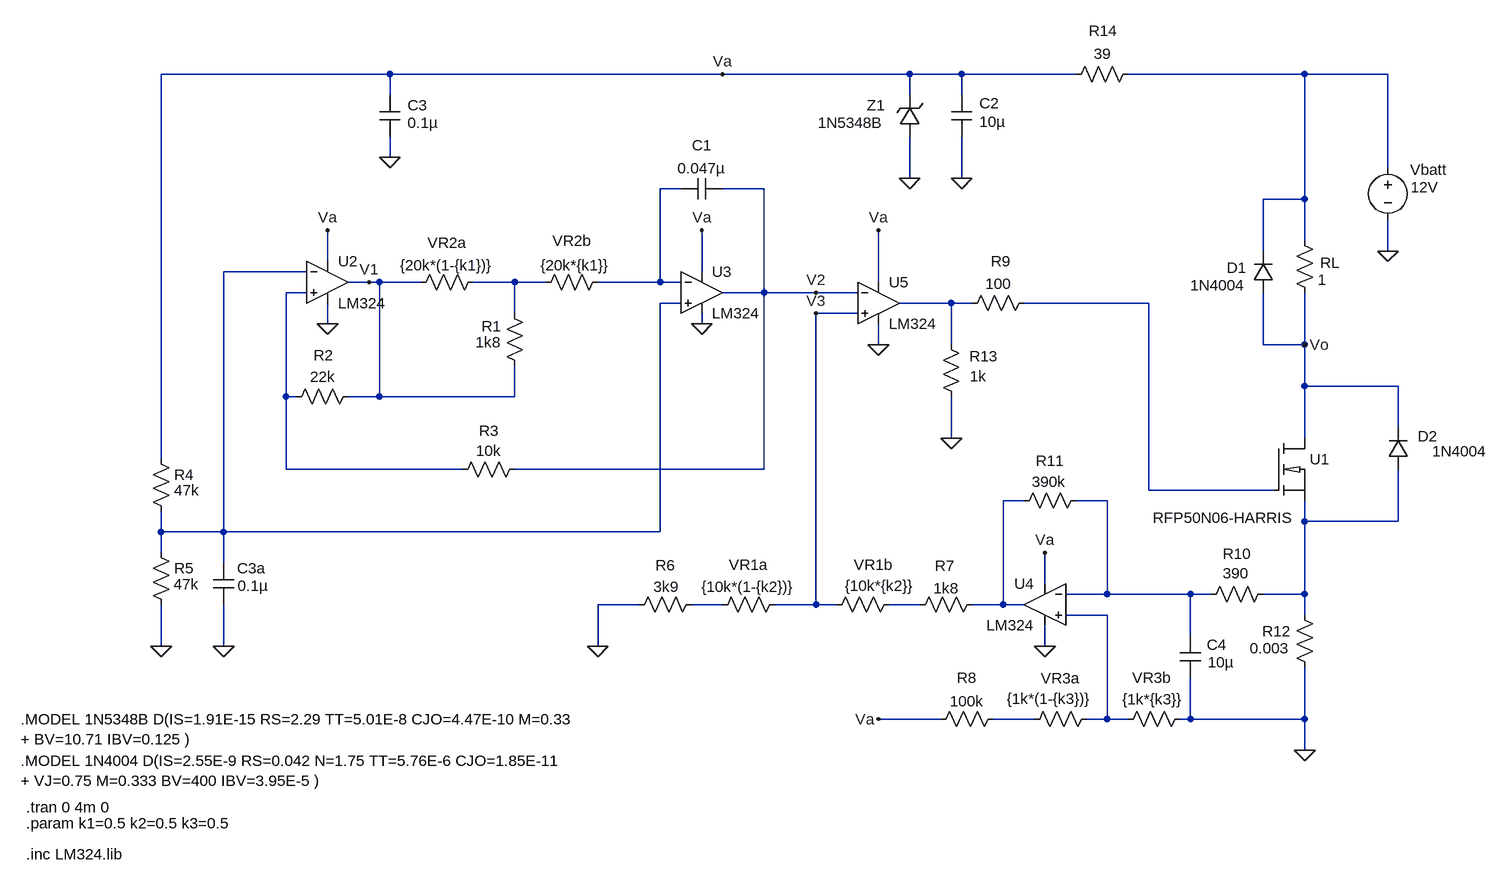
[diagram p0: schematic Actividad de PWM.asc]
Actividad de PWM.asc, the LTspice schematic file:
Version 4
SHEET 1 1620 1800
WIRE -256 -672 -608 -672
WIRE 256 -672 -256 -672
WIRE 544 -672 256 -672
WIRE 624 -672 544 -672
WIRE 800 -672 624 -672
WIRE 1152 -672 880 -672
WIRE 1280 -672 1152 -672
WIRE -256 -640 -256 -672
WIRE 544 -640 544 -672
WIRE 624 -640 624 -672
WIRE -256 -544 -256 -576
WIRE 1280 -528 1280 -672
WIRE 544 -512 544 -576
WIRE 624 -512 624 -576
WIRE 192 -496 160 -496
WIRE 320 -496 256 -496
WIRE 1152 -480 1152 -672
WIRE 1152 -480 1088 -480
WIRE 1152 -416 1152 -480
WIRE 1088 -400 1088 -480
WIRE 1280 -400 1280 -448
WIRE -352 -384 -352 -432
WIRE -384 -368 -512 -368
WIRE 224 -368 224 -432
WIRE -288 -352 -320 -352
WIRE -272 -352 -288 -352
WIRE -208 -352 -272 -352
WIRE -64 -352 -128 -352
WIRE -16 -352 -64 -352
WIRE 160 -352 160 -496
WIRE 160 -352 64 -352
WIRE 192 -352 160 -352
WIRE 496 -352 496 -432
WIRE -384 -336 -416 -336
WIRE 320 -336 320 -496
WIRE 320 -336 256 -336
WIRE 400 -336 320 -336
WIRE 464 -336 400 -336
WIRE 192 -320 160 -320
WIRE 608 -320 528 -320
WIRE 640 -320 608 -320
WIRE 912 -320 720 -320
WIRE -64 -304 -64 -352
WIRE 464 -304 400 -304
WIRE -352 -288 -352 -320
WIRE 224 -288 224 -304
WIRE 496 -256 496 -288
WIRE 608 -256 608 -320
WIRE 1088 -256 1088 -336
WIRE 1152 -256 1152 -336
WIRE 1152 -256 1088 -256
WIRE 1152 -192 1152 -256
WIRE 1296 -192 1152 -192
WIRE -416 -176 -416 -336
WIRE -400 -176 -416 -176
WIRE -272 -176 -272 -352
WIRE -272 -176 -320 -176
WIRE -64 -176 -64 -224
WIRE -64 -176 -272 -176
WIRE 1296 -128 1296 -192
WIRE 608 -112 608 -176
WIRE 1152 -112 1152 -192
WIRE -608 -80 -608 -672
WIRE -416 -64 -416 -176
WIRE -144 -64 -416 -64
WIRE 320 -64 320 -336
WIRE 320 -64 -64 -64
WIRE 912 -32 912 -320
WIRE 1104 -32 912 -32
WIRE 720 -16 688 -16
WIRE 848 -16 800 -16
WIRE 1152 16 1152 -16
WIRE 1296 16 1296 -64
WIRE 1296 16 1152 16
WIRE -608 32 -608 0
WIRE -512 32 -512 -368
WIRE -512 32 -608 32
WIRE 160 32 160 -320
WIRE 160 32 -512 32
WIRE -608 64 -608 32
WIRE -512 80 -512 32
WIRE 752 112 752 64
WIRE 848 128 848 -16
WIRE 848 128 784 128
WIRE 976 128 848 128
WIRE 1008 128 976 128
WIRE 1152 128 1152 16
WIRE 1152 128 1088 128
WIRE 128 144 64 144
WIRE 256 144 208 144
WIRE 400 144 400 -304
WIRE 400 144 336 144
WIRE 432 144 400 144
WIRE 560 144 512 144
WIRE 688 144 688 -16
WIRE 688 144 640 144
WIRE 720 144 688 144
WIRE 848 160 784 160
WIRE 1152 160 1152 128
WIRE 976 192 976 128
WIRE -608 208 -608 144
WIRE -512 208 -512 144
WIRE 64 208 64 144
WIRE 752 208 752 176
WIRE 592 320 496 320
WIRE 736 320 672 320
WIRE 848 320 848 160
WIRE 848 320 816 320
WIRE 880 320 848 320
WIRE 976 320 976 256
WIRE 976 320 960 320
WIRE 1152 320 1152 240
WIRE 1152 320 976 320
WIRE 1152 368 1152 320
FLAG -608 208 0
FLAG 1280 -400 0
FLAG 496 -256 0
FLAG -352 -288 0
FLAG 224 -288 0
FLAG -352 -432 Va
FLAG 224 -432 Va
FLAG 496 -432 Va
FLAG -512 208 0
FLAG -256 -544 0
FLAG 544 -512 0
FLAG 624 -512 0
FLAG 608 -112 0
FLAG 64 208 0
FLAG 752 208 0
FLAG 752 64 Va
FLAG 1152 368 0
FLAG 256 -672 Va
FLAG 496 320 Va
FLAG 400 -336 V2
FLAG 400 -304 V3
FLAG 1152 -256 Vo
FLAG -288 -352 V1
DATAFLAG 512 -240 ""
SYMBOL res -304 -192 R90
WINDOW 0 -32 54 VBottom 2
WINDOW 3 -30 55 VTop 2
SYMATTR InstName R2
SYMATTR Value 22k
SYMBOL res -48 -208 R180
WINDOW 0 36 76 Left 2
WINDOW 3 37 52 Left 2
SYMATTR InstName R1
SYMATTR Value 1k8
SYMBOL res -624 48 R0
WINDOW 3 35 65 Left 2
SYMATTR Value 47k
SYMATTR InstName R5
SYMBOL res -624 -96 R0
WINDOW 3 36 64 Left 2
SYMATTR Value 47k
SYMATTR InstName R4
SYMBOL res -112 -368 R90
WINDOW 0 -29 56 VBottom 2
WINDOW 3 -26 56 VTop 2
SYMATTR InstName VR2a
SYMATTR Value {20k*(1-{k1})}
SYMBOL res 80 -368 R90
WINDOW 0 -32 56 VBottom 2
WINDOW 3 -26 51 VTop 2
SYMATTR InstName VR2b
SYMATTR Value {20k*{k1}}
SYMBOL res -160 -48 R270
WINDOW 0 60 57 VTop 2
WINDOW 3 60 56 VBottom 2
SYMATTR InstName R3
SYMATTR Value 10k
SYMBOL voltage 1280 -544 R0
WINDOW 0 34 19 Left 2
WINDOW 3 35 46 Left 2
SYMATTR InstName Vbatt
SYMATTR Value 12V
SYMBOL cap 256 -512 R90
WINDOW 0 -35 32 VBottom 2
WINDOW 3 -31 32 VTop 2
SYMATTR InstName C1
SYMATTR Value 0.047µ
SYMBOL cap -528 80 R0
WINDOW 0 37 8 Left 2
WINDOW 3 38 35 Left 2
SYMATTR InstName C3a
SYMATTR Value 0.1µ
SYMBOL cap -272 -640 R0
WINDOW 0 43 16 Left 2
WINDOW 3 43 43 Left 2
SYMATTR InstName C3
SYMATTR Value 0.1µ
SYMBOL res 896 -688 R90
WINDOW 0 -35 54 VBottom 2
WINDOW 3 -31 55 VTop 2
SYMATTR InstName R14
SYMATTR Value 39
SYMBOL cap 608 -640 R0
WINDOW 0 43 13 Left 2
WINDOW 3 43 41 Left 2
SYMATTR InstName C2
SYMATTR Value 10µ
SYMBOL zener 560 -576 R180
WINDOW 0 53 48 Left 2
WINDOW 3 57 21 Left 2
SYMATTR InstName Z1
SYMATTR Value 1N5348B
SYMBOL res 352 128 R90
WINDOW 0 -30 56 VBottom 2
WINDOW 3 -27 56 VTop 2
SYMATTR InstName VR1a
SYMATTR Value {10k*(1-{k2})}
SYMBOL res 528 128 R90
WINDOW 0 -30 40 VBottom 2
WINDOW 3 -29 30 VTop 2
SYMATTR InstName VR1b
SYMATTR Value {10k*{k2}}
SYMBOL res 656 128 R90
WINDOW 0 -28 58 VBottom 2
WINDOW 3 -25 56 VTop 2
SYMATTR InstName R7
SYMATTR Value 1k8
SYMBOL res 224 128 R90
WINDOW 0 -29 56 VBottom 2
WINDOW 3 -27 55 VTop 2
SYMATTR InstName R6
SYMATTR Value 3k9
SYMBOL res 832 304 R90
WINDOW 0 -31 56 VBottom 2
WINDOW 3 -31 73 VTop 2
SYMATTR InstName VR3a
SYMATTR Value {1k*(1-{k3})}
SYMBOL res 976 304 R90
WINDOW 0 -32 59 VBottom 2
WINDOW 3 -30 58 VTop 2
SYMATTR InstName VR3b
SYMATTR Value {1k*{k3}}
SYMBOL res 688 304 R90
WINDOW 0 -32 56 VBottom 2
WINDOW 3 -27 56 VTop 2
SYMATTR InstName R8
SYMATTR Value 100k
SYMBOL res 816 -32 R90
WINDOW 0 -30 56 VBottom 2
WINDOW 3 -29 58 VTop 2
SYMATTR InstName R11
SYMATTR Value 390k
SYMBOL res 1168 256 R180
WINDOW 0 37 71 Left 2
WINDOW 3 40 45 Left 2
SYMATTR InstName R12
SYMATTR Value 0.003
SYMBOL res 624 -304 R270
WINDOW 0 65 60 VTop 2
WINDOW 3 61 57 VBottom 2
SYMATTR InstName R9
SYMATTR Value 100
SYMBOL res 592 -272 R0
WINDOW 0 44 34 Left 2
WINDOW 3 45 65 Left 2
SYMATTR InstName R13
SYMATTR Value 1k
SYMBOL res 1104 112 R90
WINDOW 0 -31 56 VBottom 2
WINDOW 3 -32 58 VTop 2
SYMATTR InstName R10
SYMATTR Value 390
SYMBOL cap 960 192 R0
WINDOW 0 41 14 Left 2
WINDOW 3 43 41 Left 2
SYMATTR InstName C4
SYMATTR Value 10µ
SYMBOL diode 1104 -336 R180
WINDOW 0 41 38 Left 2
WINDOW 3 43 11 Left 2
SYMATTR InstName D1
SYMATTR Value 1N4004
SYMBOL diode 1312 -64 R180
WINDOW 0 -45 51 Left 2
WINDOW 3 -121 28 Left 2
SYMATTR InstName D2
SYMATTR Value 1N4004
SYMBOL RFP50N06-HARRIS 1104 -112 R0
WINDOW 3 -77 107 Top 2
SYMATTR InstName U1
SYMBOL res 1136 -432 R0
WINDOW 0 40 50 Left 2
SYMATTR InstName RL
SYMATTR Value 1
SYMBOL OpAmps\\opamp2 -352 -416 R0
SYMATTR InstName U2
SYMATTR Value LM324
SYMBOL OpAmps\\opamp2 224 -400 R0
SYMATTR InstName U3
SYMATTR Value LM324
SYMBOL OpAmps\\opamp2 752 80 M0
SYMATTR InstName U4
SYMATTR Value LM324
SYMBOL OpAmps\\opamp2 496 -384 R0
SYMATTR InstName U5
SYMATTR Value LM324
TEXT -824 320 Left 2 !.MODEL 1N5348B D(IS=1.91E-15 RS=2.29 TT=5.01E-8 CJO=4.47E-10 M=0.33 \n+ BV=10.71 IBV=0.125 )
TEXT -824 384 Left 2 !.MODEL 1N4004 D(IS=2.55E-9 RS=0.042 N=1.75 TT=5.76E-6 CJO=1.85E-11 \n+ VJ=0.75 M=0.333 BV=400 IBV=3.95E-5 )
TEXT -816 456 Left 2 !.tran 0 4m 0
TEXT -816 480 Left 2 !.param k1=0.5 k2=0.5 k3=0.5
TEXT -816 528 Left 2 !.inc LM324.lib

The netlist it stands for:
* Actividad de PWM.asc
R2 V1 N005 22k
R1 V1 N004 1k8
R5 N003 0 47k
R4 Va N003 47k
R§VR2a N004 V1 {20k*(1-{k1})}
R§VR2b N002 N004 {20k*{k1}}
R3 N005 V2 10k
Vbatt N001 0 12V
C1 V2 N002 0.047µ
C3a N003 0 0.1µ
C3 Va 0 0.1µ
R14 N001 Va 39
C2 Va 0 10µ
D§Z1 0 Va 1N5348B
R§VR1a V3 N011 {10k*(1-{k2})}
R§VR1b N012 V3 {10k*{k2}}
R7 N008 N012 1k8
R6 N011 0 3k9
R§VR3a N013 N014 {1k*(1-{k3})}
R§VR3b 0 N013 {1k*{k3}}
R8 N014 Va 100k
R11 N009 N008 390k
R12 0 N010 0.003
R9 N006 N007 100
R13 N006 0 1k
R10 N010 N009 390
C4 N009 0 10µ
D1 Vo N001 1N4004
D2 N010 Vo 1N4004
XU1 Vo N007 N010 RFP50N06-HARRIS  ; pins D G S
RL N001 Vo 1
XU2 N005 N003 Va 0 V1 LM324  ; pins In+ In- V+ V- OUT
XU3 N003 N002 Va 0 V2 LM324  ; pins In+ In- V+ V- OUT
XU4 N013 N009 Va 0 N008 LM324  ; pins In+ In- V+ V- OUT
XU5 V3 V2 Va 0 N006 LM324  ; pins In+ In- V+ V- OUT
.model D D
.lib standard.dio
.MODEL 1N5348B D(IS=1.91E-15 RS=2.29 TT=5.01E-8 CJO=4.47E-10 M=0.33
+ BV=10.71 IBV=0.125 )
.MODEL 1N4004 D(IS=2.55E-9 RS=0.042 N=1.75 TT=5.76E-6 CJO=1.85E-11
+ VJ=0.75 M=0.333 BV=400 IBV=3.95E-5 )
.tran 0 4m 0
.param k1=0.5 k2=0.5 k3=0.5
.inc LM324.lib
.lib C:\Users\Marce\Downloads\RFP50N06.txt
.backanno
.end